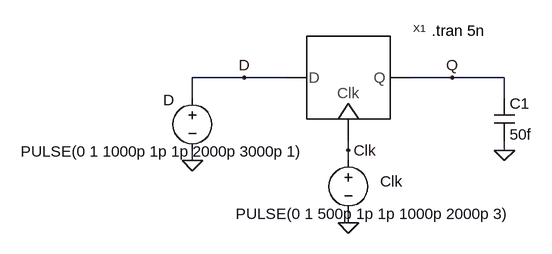
[diagram p0: schematic 2-D_FF.asc]
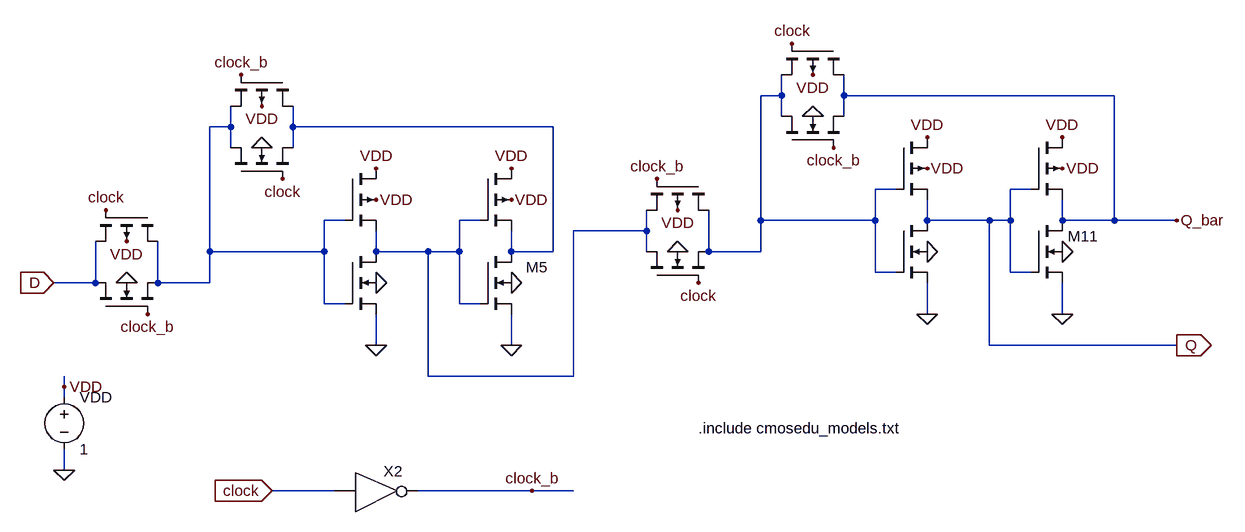
[diagram p1: sub-circuit d_ff.asc]
2-D_FF.asc, the LTspice schematic file:
Version 4
SHEET 1 1136 680
WIRE 448 -272 368 -272
WIRE 512 -272 448 -272
WIRE 768 -272 704 -272
WIRE 848 -272 768 -272
WIRE 368 -240 368 -272
WIRE 848 -240 848 -272
WIRE 608 -160 608 -176
WIRE 848 -160 848 -176
WIRE 368 -144 368 -160
WIRE 608 -144 608 -160
WIRE 608 -48 608 -64
FLAG 608 -48 0
FLAG 768 -272 Q
FLAG 848 -160 0
FLAG 368 -144 0
FLAG 448 -272 D
FLAG 608 -160 Clk
SYMBOL voltage 608 -160 R0
WINDOW 0 49 48 Left 2
WINDOW 3 -173 98 Left 2
WINDOW 123 0 0 Left 2
WINDOW 39 0 0 Left 2
SYMATTR InstName Clk
SYMATTR Value PULSE(0 1 500p 1p 1p 1000p 2000p 3)
SYMBOL cap 832 -240 R0
SYMATTR InstName C1
SYMATTR Value 50f
SYMBOL voltage 368 -256 R0
WINDOW 0 -45 19 Left 2
WINDOW 3 -264 98 Left 2
WINDOW 123 0 0 Left 2
WINDOW 39 0 0 Left 2
SYMATTR InstName D
SYMATTR Value PULSE(0 1 1000p 1p 1p 2000p 3000p 1)
SYMBOL D_FF 608 -272 R0
SYMATTR InstName X1
TEXT 736 -344 Left 2 !.tran 5n

d_ff.asc, the sub-circuit schematic file:
Version 4
SHEET 1 1820 680
WIRE 1120 -688 1120 -720
WIRE 1120 -688 1088 -688
WIRE 1216 -688 1216 -720
WIRE 1632 -688 1216 -688
WIRE 1120 -656 1120 -688
WIRE 1216 -656 1216 -688
WIRE 272 -640 272 -672
WIRE 272 -640 240 -640
WIRE 368 -640 368 -672
WIRE 768 -640 368 -640
WIRE 272 -608 272 -640
WIRE 368 -608 368 -640
WIRE 1296 -544 1264 -544
WIRE 1504 -544 1472 -544
WIRE 448 -496 416 -496
WIRE 656 -496 624 -496
WIRE 1088 -496 1088 -688
WIRE 1264 -496 1264 -544
WIRE 1264 -496 1088 -496
WIRE 1344 -496 1344 -528
WIRE 1440 -496 1344 -496
WIRE 1472 -496 1472 -544
WIRE 1472 -496 1440 -496
WIRE 1552 -496 1552 -528
WIRE 1632 -496 1632 -688
WIRE 1632 -496 1552 -496
WIRE 1728 -496 1632 -496
WIRE 912 -480 912 -512
WIRE 912 -480 800 -480
WIRE 240 -448 240 -640
WIRE 416 -448 416 -496
WIRE 416 -448 240 -448
WIRE 496 -448 496 -480
WIRE 576 -448 496 -448
WIRE 624 -448 624 -496
WIRE 624 -448 576 -448
WIRE 704 -448 704 -480
WIRE 768 -448 768 -640
WIRE 768 -448 704 -448
WIRE 912 -448 912 -480
WIRE 1008 -448 1008 -512
WIRE 1088 -448 1088 -496
WIRE 1088 -448 1008 -448
WIRE 1264 -416 1264 -496
WIRE 1296 -416 1264 -416
WIRE 1472 -416 1472 -496
WIRE 1504 -416 1472 -416
WIRE 64 -400 64 -464
WIRE 64 -400 0 -400
WIRE 160 -400 160 -464
WIRE 240 -400 240 -448
WIRE 240 -400 160 -400
WIRE 416 -368 416 -448
WIRE 448 -368 416 -368
WIRE 624 -368 624 -448
WIRE 656 -368 624 -368
WIRE 1344 -352 1344 -400
WIRE 1552 -352 1552 -400
WIRE 496 -304 496 -352
WIRE 704 -304 704 -352
WIRE 1440 -304 1440 -496
WIRE 1728 -304 1440 -304
WIRE 576 -256 576 -448
WIRE 800 -256 800 -480
WIRE 800 -256 576 -256
WIRE 16 -240 16 -256
WIRE 16 -224 16 -240
WIRE 16 -112 16 -144
WIRE 432 -80 336 -80
WIRE 736 -80 560 -80
WIRE 800 -80 736 -80
FLAG 496 -400 0
FLAG 16 -112 0
FLAG 16 -240 VDD
FLAG 496 -528 VDD
FLAG 496 -304 0
FLAG 496 -576 VDD
FLAG 704 -400 0
FLAG 704 -528 VDD
FLAG 704 -304 0
FLAG 704 -576 VDD
FLAG 112 -400 0
FLAG 144 -352 clock_b
FLAG 112 -464 VDD
FLAG 80 -512 clock
FLAG 320 -608 0
FLAG 352 -560 clock
FLAG 320 -672 VDD
FLAG 288 -720 clock_b
FLAG 1344 -448 0
FLAG 1344 -576 VDD
FLAG 1344 -352 0
FLAG 1344 -624 VDD
FLAG 1552 -448 0
FLAG 1552 -576 VDD
FLAG 1552 -352 0
FLAG 1552 -624 VDD
FLAG 960 -448 0
FLAG 992 -400 clock
FLAG 1728 -496 Q_bar
FLAG 960 -512 VDD
FLAG 928 -560 clock_b
FLAG 1168 -656 0
FLAG 1200 -608 clock_b
FLAG 1168 -720 VDD
FLAG 1136 -768 clock
FLAG 1728 -304 Q
IOPIN 1728 -304 Out
FLAG 0 -400 D
IOPIN 0 -400 In
FLAG 336 -80 clock
IOPIN 336 -80 In
FLAG 736 -80 clock_b
SYMBOL nmos4 448 -448 R0
WINDOW 0 104 24 Invisible 2
WINDOW 3 179 41 Invisible 2
SYMATTR InstName M1
SYMATTR Value N_50n
SYMATTR Value2 l=50n w=500n
SYMBOL voltage 16 -240 R0
WINDOW 123 0 0 Left 2
WINDOW 39 0 0 Left 2
SYMATTR InstName VDD
SYMATTR Value 1
SYMBOL pmos4 448 -576 R0
WINDOW 0 88 9 Invisible 2
WINDOW 3 168 20 Invisible 2
SYMATTR InstName M2
SYMATTR Value P_50n
SYMATTR Value2 l=50n w=1u
SYMBOL nmos4 656 -448 R0
WINDOW 0 104 24 Right 2
WINDOW 3 179 41 Invisible 2
SYMATTR InstName M5
SYMATTR Value N_50n
SYMATTR Value2 l=50n w=500n
SYMBOL pmos4 656 -576 R0
WINDOW 0 88 9 Invisible 2
WINDOW 3 168 20 Invisible 2
SYMATTR InstName M6
SYMATTR Value P_50n
SYMATTR Value2 l=50n w=1u
SYMBOL nmos4 64 -352 R270
WINDOW 0 86 42 Invisible 2
WINDOW 3 82 140 Invisible 2
SYMATTR InstName M7
SYMATTR Value N_50n
SYMATTR Value2 l=50n w=500n
SYMBOL pmos4 160 -512 R90
WINDOW 0 71 26 Invisible 2
WINDOW 3 75 133 Invisible 2
SYMATTR InstName M3
SYMATTR Value P_50n
SYMATTR Value2 l=50n w=1u
SYMBOL nmos4 272 -560 R270
WINDOW 0 86 42 Invisible 2
WINDOW 3 82 140 Invisible 2
SYMATTR InstName M4
SYMATTR Value N_50n
SYMATTR Value2 l=50n w=500n
SYMBOL pmos4 368 -720 R90
WINDOW 0 71 26 Invisible 2
WINDOW 3 75 133 Invisible 2
SYMATTR InstName M8
SYMATTR Value P_50n
SYMATTR Value2 l=50n w=1u
SYMBOL nmos4 1296 -496 R0
WINDOW 0 104 24 Invisible 2
WINDOW 3 179 41 Invisible 2
SYMATTR InstName M9
SYMATTR Value N_50n
SYMATTR Value2 l=50n w=500n
SYMBOL pmos4 1296 -624 R0
WINDOW 0 88 9 Invisible 2
WINDOW 3 168 20 Invisible 2
SYMATTR InstName M10
SYMATTR Value P_50n
SYMATTR Value2 l=50n w=1u
SYMBOL nmos4 1504 -496 R0
WINDOW 0 104 24 Right 2
WINDOW 3 179 41 Invisible 2
SYMATTR InstName M11
SYMATTR Value N_50n
SYMATTR Value2 l=50n w=500n
SYMBOL pmos4 1504 -624 R0
WINDOW 0 88 9 Invisible 2
WINDOW 3 168 20 Invisible 2
SYMATTR InstName M12
SYMATTR Value P_50n
SYMATTR Value2 l=50n w=1u
SYMBOL nmos4 912 -400 R270
WINDOW 0 86 42 Invisible 2
WINDOW 3 82 140 Invisible 2
SYMATTR InstName M13
SYMATTR Value N_50n
SYMATTR Value2 l=50n w=500n
SYMBOL pmos4 1008 -560 R90
WINDOW 0 71 26 Invisible 2
WINDOW 3 75 133 Invisible 2
SYMATTR InstName M14
SYMATTR Value P_50n
SYMATTR Value2 l=50n w=1u
SYMBOL nmos4 1120 -608 R270
WINDOW 0 86 42 Invisible 2
WINDOW 3 82 140 Invisible 2
SYMATTR InstName M15
SYMATTR Value N_50n
SYMATTR Value2 l=50n w=500n
SYMBOL pmos4 1216 -768 R90
WINDOW 0 71 26 Invisible 2
WINDOW 3 75 133 Invisible 2
SYMATTR InstName M16
SYMATTR Value P_50n
SYMATTR Value2 l=50n w=1u
SYMBOL NOT 464 -112 R0
SYMATTR InstName X2
TEXT 992 -176 Left 2 !.include cmosedu_models.txt

The netlist it stands for:
* 2-D_FF.asc
V§Clk Clk 0 PULSE(0 1 500p 1p 1p 1000p 2000p 3)
C1 Q 0 50f
V§D D 0 PULSE(0 1 1000p 1p 1p 2000p 3000p 1)
XX1 D Q Clk d_ff

* block symbol definitions
.subckt d_ff D Q clock
M1 N004 N002 0 0 N_50n l=50n w=500n
VDD VDD 0 1
M2 VDD N002 N004 VDD P_50n l=50n w=1u
M5 N003 N004 0 0 N_50n l=50n w=500n
M6 VDD N004 N003 VDD P_50n l=50n w=1u
M7 D clock_b N002 0 N_50n l=50n w=500n
M3 N002 clock D VDD P_50n l=50n w=1u
M4 N002 clock N003 0 N_50n l=50n w=500n
M8 N003 clock_b N002 VDD P_50n l=50n w=1u
M9 Q N001 0 0 N_50n l=50n w=500n
M10 VDD N001 Q VDD P_50n l=50n w=1u
M11 Q_bar Q 0 0 N_50n l=50n w=500n
M12 VDD Q Q_bar VDD P_50n l=50n w=1u
M13 N004 clock N001 0 N_50n l=50n w=500n
M14 N001 clock_b N004 VDD P_50n l=50n w=1u
M15 N001 clock_b Q_bar 0 N_50n l=50n w=500n
M16 Q_bar clock N001 VDD P_50n l=50n w=1u
XX2 clock clock_b NOT  ; pins In Out
.include cmosedu_models.txt
.ends d_ff

.model NMOS NMOS
.model PMOS PMOS
.lib standard.mos
.tran 5n
.backanno
.end